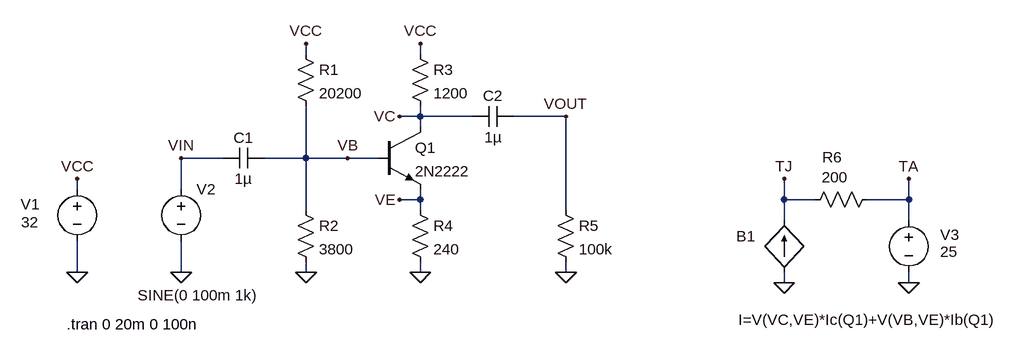
[diagram p0: schematic SignalAmp.asc]
SignalAmp.asc, the LTspice schematic file:
Version 4
SHEET 1 2036 680
WIRE 16 0 16 -16
WIRE 192 0 192 -16
WIRE 192 96 192 80
WIRE 192 96 160 96
WIRE 272 96 192 96
WIRE 416 96 336 96
WIRE 192 112 192 96
WIRE -112 160 -176 160
WIRE 16 160 16 80
WIRE 16 160 -48 160
WIRE 80 160 16 160
WIRE 128 160 80 160
WIRE -336 208 -336 192
WIRE -176 208 -176 160
WIRE 192 224 192 208
WIRE 192 224 160 224
WIRE 752 224 752 192
WIRE 800 224 752 224
WIRE 944 224 944 192
WIRE 944 224 880 224
WIRE 16 240 16 160
WIRE 192 240 192 224
WIRE 416 240 416 96
WIRE 752 256 752 224
WIRE 944 256 944 224
WIRE -336 336 -336 288
WIRE -176 336 -176 288
WIRE 16 336 16 320
WIRE 192 336 192 320
WIRE 416 336 416 320
WIRE 752 352 752 336
WIRE 944 352 944 336
FLAG -336 336 0
FLAG -336 192 VCC
FLAG 16 -16 VCC
FLAG 192 336 0
FLAG 16 336 0
FLAG 416 336 0
FLAG -176 336 0
FLAG -176 160 VIN
FLAG 416 96 VOUT
FLAG 160 96 VC
FLAG 160 224 VE
FLAG 80 160 VB
FLAG 192 -16 VCC
FLAG 752 352 0
FLAG 944 352 0
FLAG 752 192 TJ
FLAG 944 192 TA
SYMBOL npn 128 112 R0
SYMATTR InstName Q1
SYMATTR Value 2N2222
SYMBOL voltage -336 192 R0
WINDOW 0 -87 39 Left 2
WINDOW 3 -86 67 Left 2
WINDOW 123 0 0 Left 0
WINDOW 39 0 0 Left 0
SYMATTR InstName V1
SYMATTR Value 32
SYMBOL res 0 -16 R0
SYMATTR InstName R1
SYMATTR Value 20200
SYMBOL res 0 224 R0
SYMATTR InstName R2
SYMATTR Value 3800
SYMBOL res 176 -16 R0
SYMATTR InstName R3
SYMATTR Value 1200
SYMBOL res 176 224 R0
SYMATTR InstName R4
SYMATTR Value 240
SYMBOL cap -48 144 R90
WINDOW 0 0 32 VBottom 2
WINDOW 3 32 32 VTop 2
SYMATTR InstName C1
SYMATTR Value 1µ
SYMBOL cap 336 80 R90
WINDOW 0 0 32 VBottom 2
WINDOW 3 32 32 VTop 2
SYMATTR InstName C2
SYMATTR Value 1µ
SYMBOL res 400 224 R0
SYMATTR InstName R5
SYMATTR Value 100k
SYMBOL voltage -176 192 R0
WINDOW 3 -67 179 Left 2
WINDOW 123 0 0 Left 0
WINDOW 39 0 0 Left 0
SYMATTR Value SINE(0 100m 1k)
SYMATTR InstName V2
SYMBOL bi 752 336 R180
WINDOW 0 44 56 Left 2
WINDOW 3 -325 -73 Left 2
SYMATTR InstName B1
SYMATTR Value I=V(VC,VE)*Ic(Q1)+V(VB,VE)*Ib(Q1)
SYMBOL res 896 208 R90
WINDOW 0 -34 70 VBottom 2
WINDOW 3 -34 66 VTop 2
SYMATTR InstName R6
SYMATTR Value 200
SYMBOL voltage 944 240 R0
WINDOW 0 48 38 Left 2
WINDOW 3 48 64 Left 2
WINDOW 123 0 0 Left 0
WINDOW 39 0 0 Left 0
SYMATTR InstName V3
SYMATTR Value 25
TEXT -352 416 Left 2 !.tran 0 20m 0 100n

The netlist it stands for:
* SignalAmp.asc
Q1 VC VB VE 0 2N2222
V1 VCC 0 32
R1 VCC VB 20200
R2 VB 0 3800
R3 VCC VC 1200
R4 VE 0 240
C1 VB VIN 1µ
C2 VOUT VC 1µ
R5 VOUT 0 100k
V2 VIN 0 SINE(0 100m 1k)
B1 0 TJ I=V(VC,VE)*Ic(Q1)+V(VB,VE)*Ib(Q1)
R6 TA TJ 200
V3 TA 0 25
.model NPN NPN
.model PNP PNP
.lib standard.bjt
.tran 0 20m 0 100n
.backanno
.end